# EasyEDA Pro project car1.eprj, schematic Schematic2_1

## Sheets
1 control: Board Name: 主板第二版; Create Date: 2025-04-05; Page Name: control; Project Name: car1; Schematic Name: Schematic2_1; Update Date: 2025-06-02; Company: 嘉立创EDA; Page Size: A4; Version: V1.0
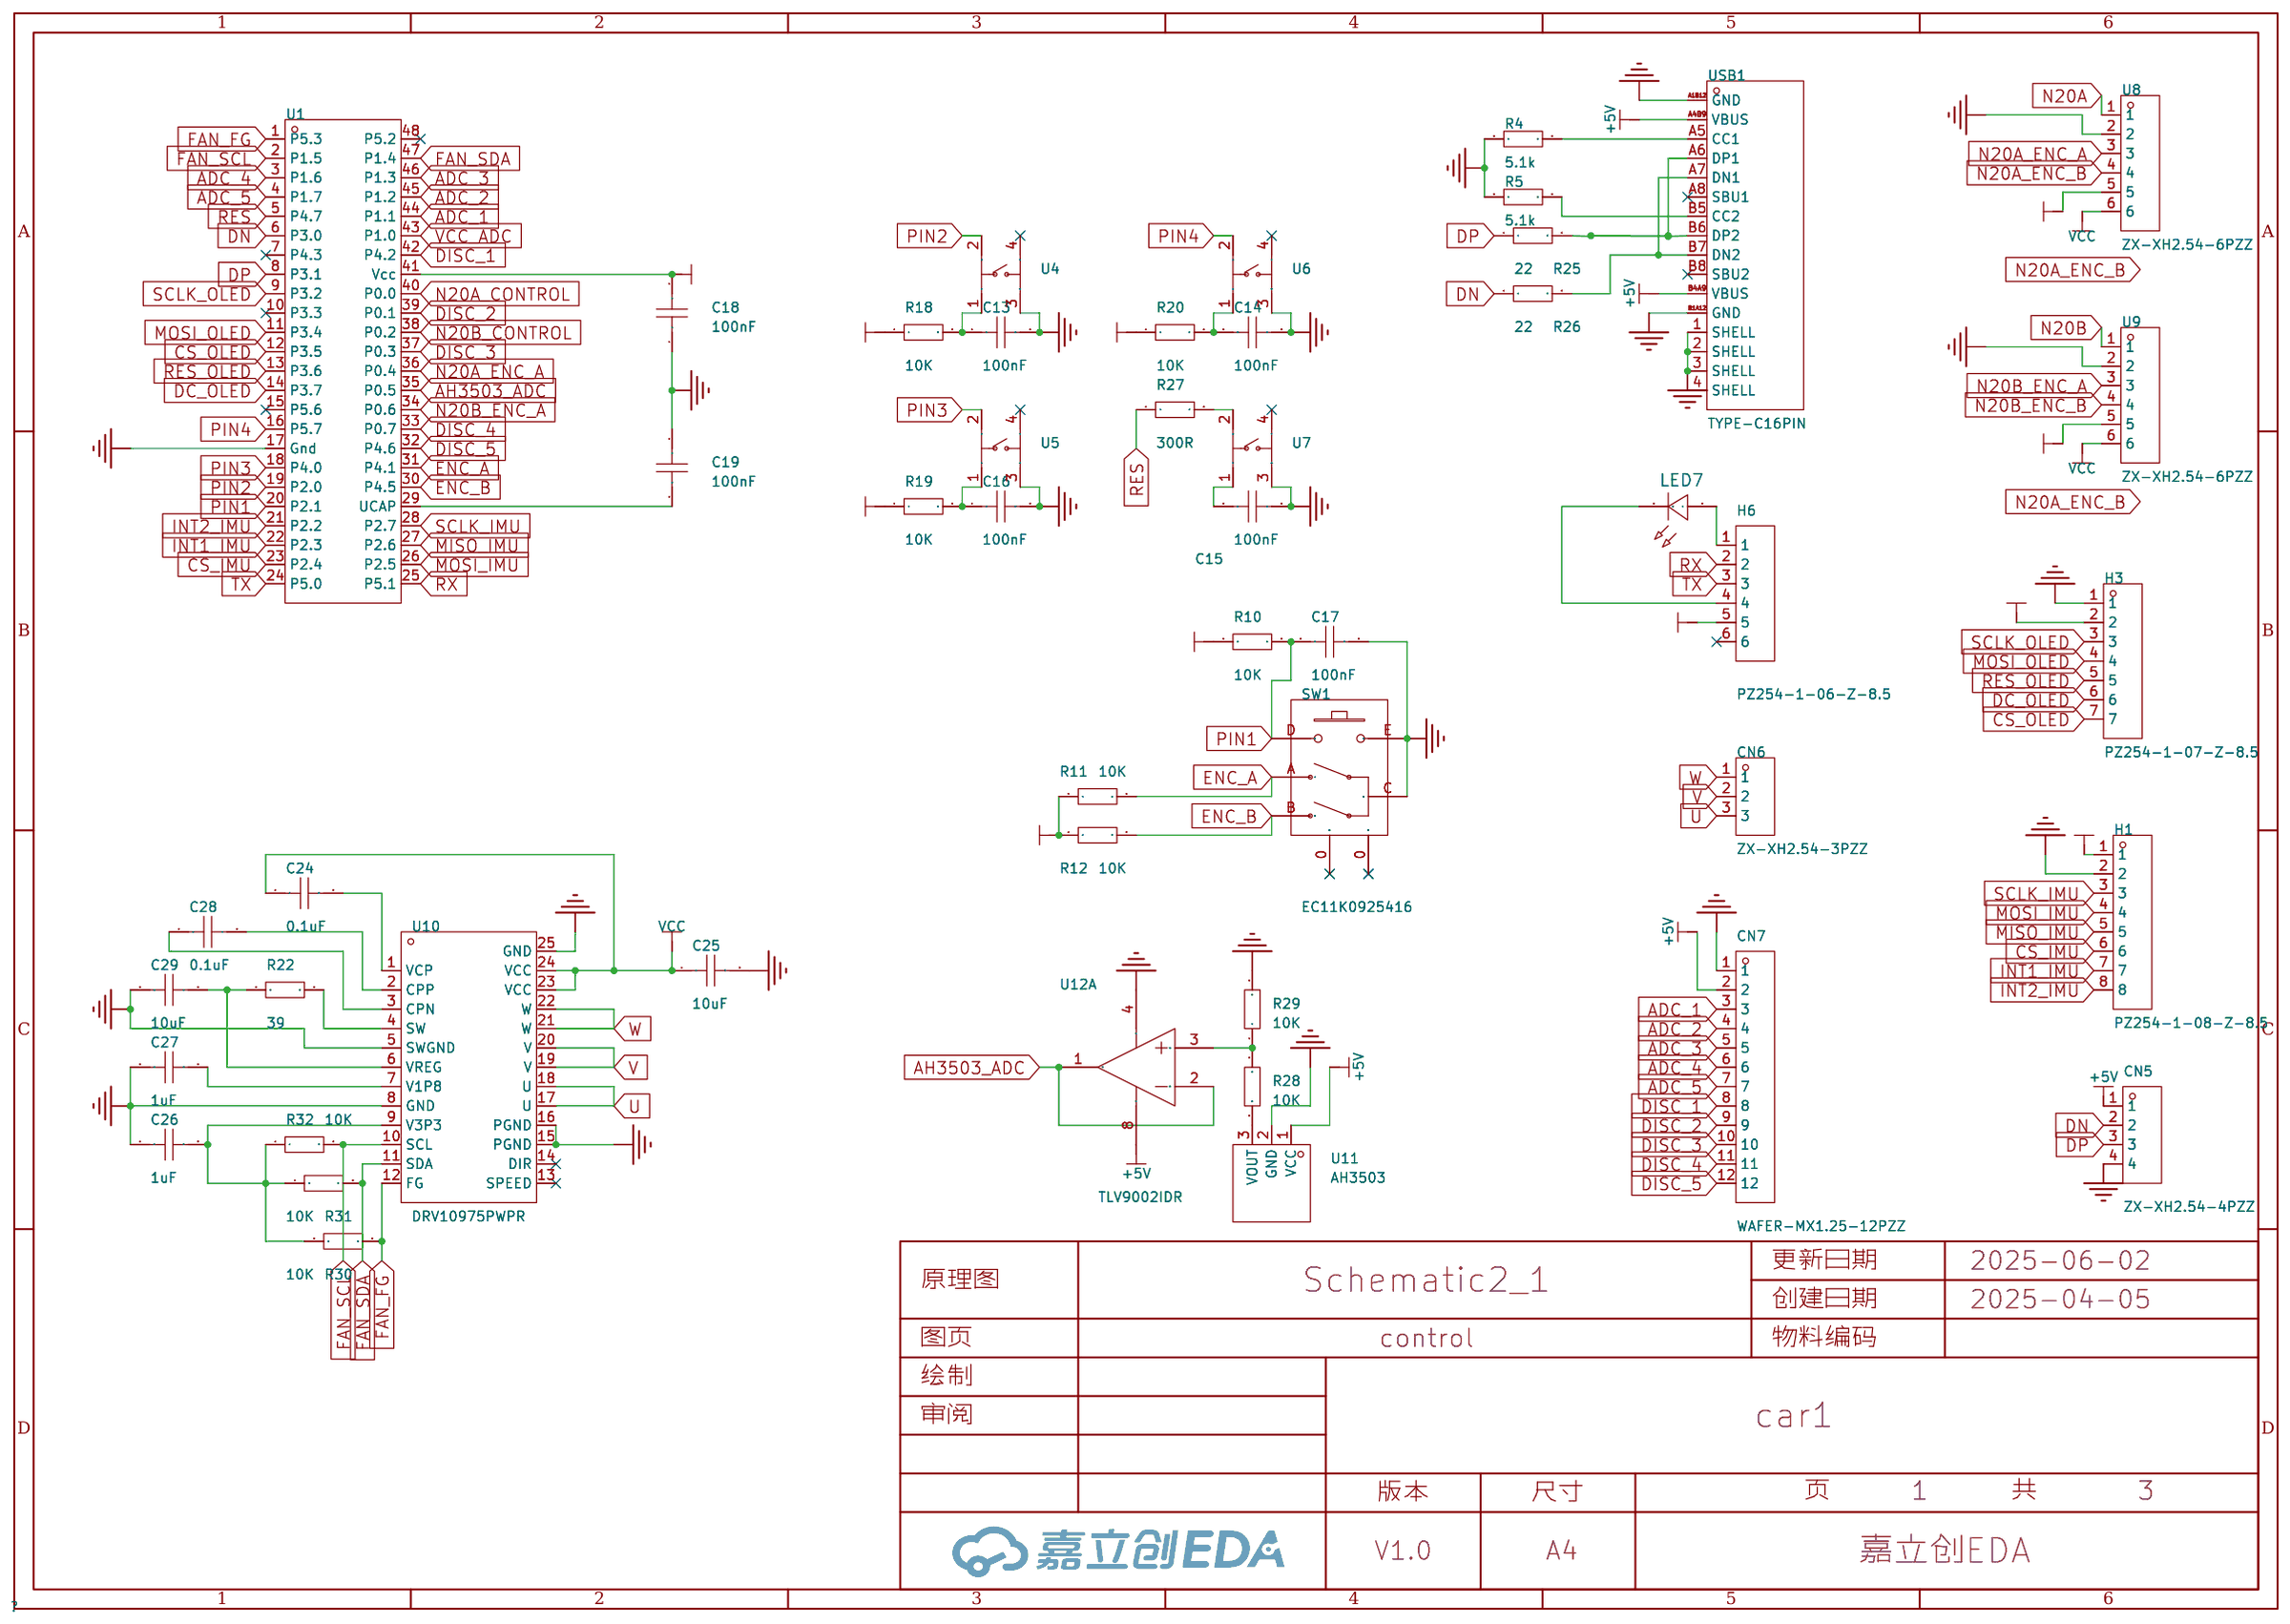
[diagram p4: control]
2 Power: Page Name: Power; Update Date: 2025-05-18
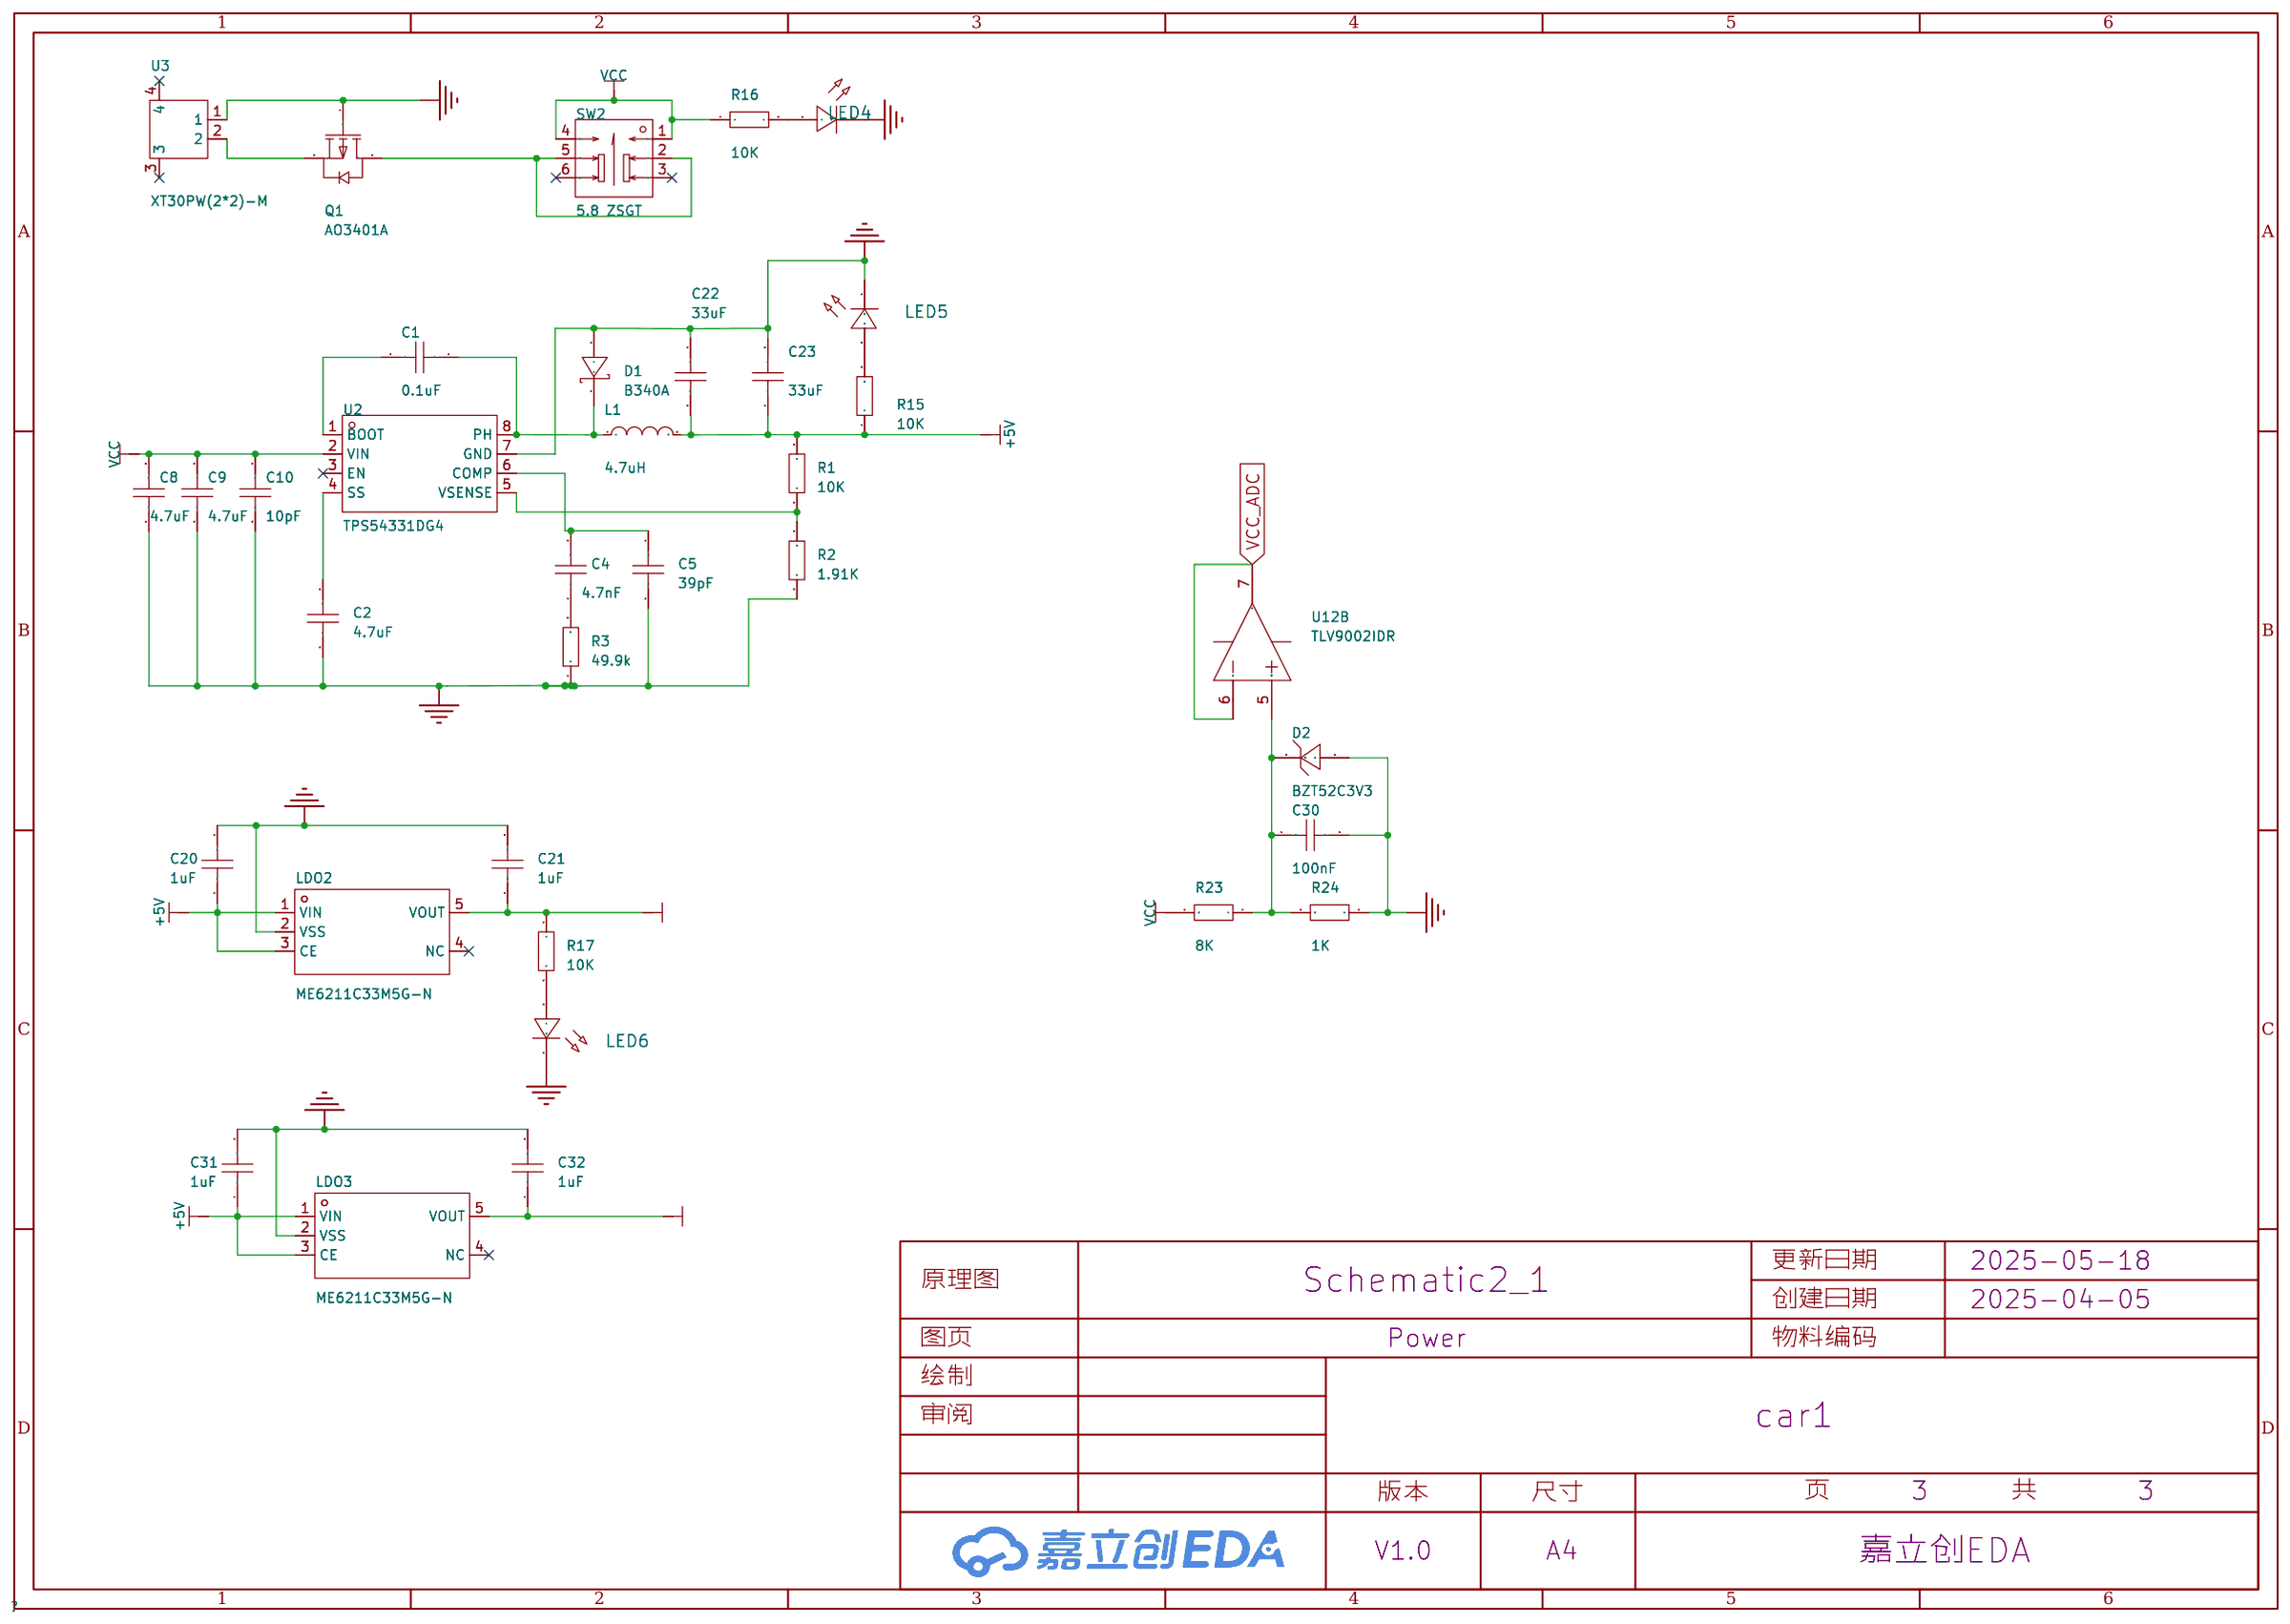
[diagram p5: Power]
3 Motor_Drive: Page Name: Motor_Drive; Update Date: 2025-05-02
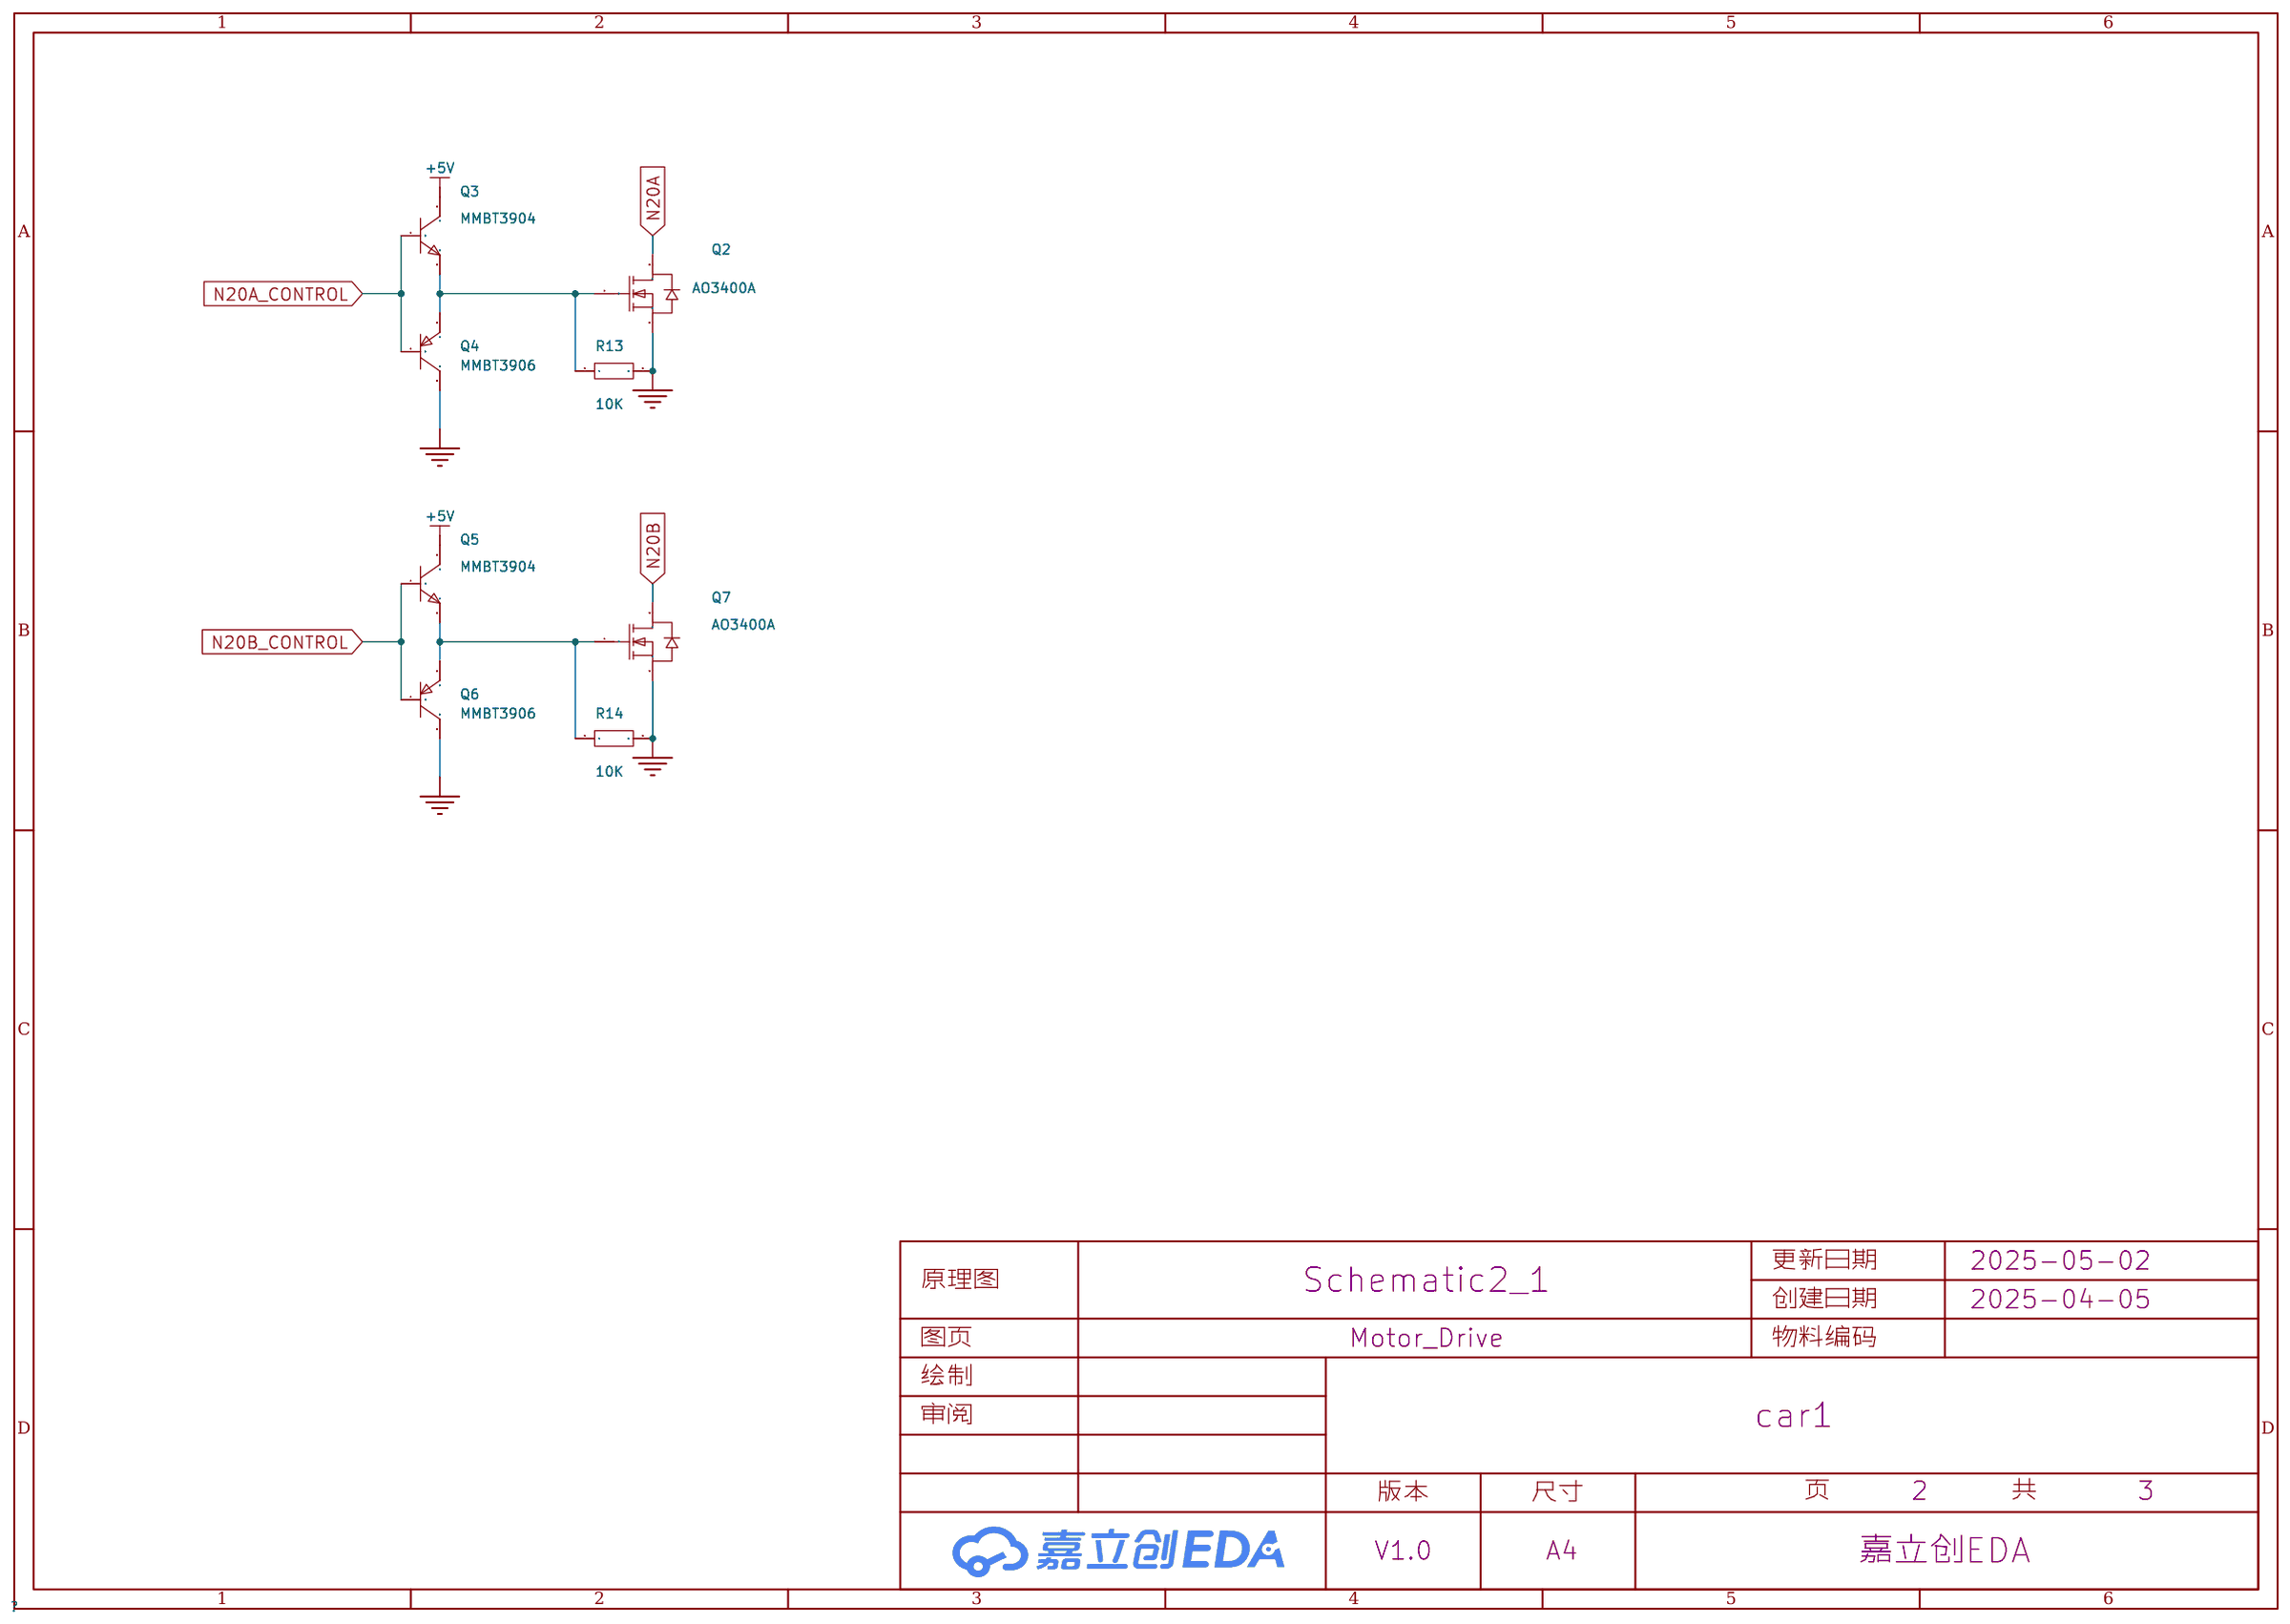
[diagram p6: Motor_Drive]

## Parts
sheet control
C13  100nF  [C0603]
C14  100nF  [C0603]
C15  100nF  [C0603]
C16  100nF  [C0603]
C17  100nF  [C0603]
C18  100nF  [C0603]
C19  100nF  [C0603]
C24  0.1uF  [C0603]
C25  10uF  [C0603]
C26  1uF  [C0603]
C27  1uF  [C0603]
C28  0.1uF  [C0603]
C29  10uF  [C0603]
CN5  ZX-XH2.54-4PZZ  [CONN-TH_4P-P2.50_4PIN]
CN6  ZX-XH2.54-3PZZ  [CONN-TH_3P-P2.54_2501S-3P]
CN7  WAFER-MX1.25-12PZZ  [CONN-TH_WAFER-MX1.25-12PZZ]
H1  PZ254-1-08-Z-8.5  [HDR-TH_8P-P2.54-V-M]
H3  PZ254-1-07-Z-8.5  [HDR-TH_07P-P2.54-V-M]
H6  PZ254-1-06-Z-8.5  [HDR-TH_06P-P2.54-V-M]
LED7  -  [LED_0603]
R4  5.1k  [R0603]
R5  5.1k  [R0603]
R10  10K  [R0603]
R11  10K  [R0603]
R12  10K  [R0603]
R18  10K  [R0603]
R19  10K  [R0603]
R20  10K  [R0603]
R22  39  [R0603]
R25  22  [R0603]
R26  22  [R0603]
R27  300R  [R0603]
R28  10K  [R0603]
R29  10K  [R0603]
R30  10K  [R0603]
R31  10K  [R0603]
R32  10K  [R0603]
SW1  EC11K0925416  [SW-TH_EC11K0925416]
U1  AI8051U-34K64-QFP48  [LQFP-48_L7.0-W7.0-P0.50-LS9.0-BL_1]
U4  TC-6610 6*6*5 160g  [SW-TH_4P-L6.0-W6.0-P4.50-LS6.5]
U5  TC-6610 6*6*5 160g  [SW-TH_4P-L6.0-W6.0-P4.50-LS6.5]
U6  TC-6610 6*6*5 160g  [SW-TH_4P-L6.0-W6.0-P4.50-LS6.5]
U7  TC-6610 6*6*5 160g  [SW-TH_4P-L6.0-W6.0-P4.50-LS6.5]
U8  ZX-XH2.54-6PZZ  [CONN-TH_6P-P2.50_ZX-XH2.54-6PZZ]
U9  ZX-XH2.54-6PZZ  [CONN-TH_6P-P2.50_ZX-XH2.54-6PZZ]
U10  DRV10975PWPR  [HTSSOP-24_L7.8-W4.4-P0.65-LS6.4-BL-EP]
U11  AH3503  [TO-92S_L4.0-W1.52-P1.27-R]
U12  TLV9002IDR  [SOIC-8_L4.9-W3.9-P1.27-LS6.0-BL]  (sections 1,2)
USB1  TYPE-C16PIN  [USB-C-SMD_TYPE-C16PIN]
sheet Motor_Drive
Q2  AO3400A  [SOT-23-3_L2.9-W1.3-P1.90-LS2.4-BR]
Q3  MMBT3904  [SOT-23-3_L2.9-W1.3-P1.90-LS2.4-BR]
Q4  MMBT3906  [SOT-23-3_L2.9-W1.3-P1.90-LS2.4-BR]
Q5  MMBT3904  [SOT-23-3_L2.9-W1.3-P1.90-LS2.4-BR]
Q6  MMBT3906  [SOT-23-3_L2.9-W1.3-P1.90-LS2.4-BR]
Q7  AO3400A  [SOT-23-3_L2.9-W1.3-P1.90-LS2.4-BR]
R13  10K  [R0603]
R14  10K  [R0603]
sheet Power
C1  0.1uF  [C0603]
C2  4.7uF  [C0603]
C4  4.7nF  [C0603]
C5  39pF  [C0603]
C8  4.7uF  [C0603]
C9  4.7uF  [C0603]
C10  10pF  [C0603]
C20  1uF  [C0603]
C21  1uF  [C0603]
C22  33uF  [C0603]
C23  33uF  [C0603]
C30  100nF  [C0603]
C31  1uF  [C0603]
C32  1uF  [C0603]
D1  B340A  [SMA_L4.3-W2.6-LS5.1-RD]
D2  BZT52C3V3  [SOD-123_L2.7-W1.6-LS3.7-RD-1]
L1  4.7uH  [IND-SMD_L4.9-W4.4_MAPM0420F]
LDO2  ME6211C33M5G-N  [SOT-23-5_L3.0-W1.7-P0.95-LS2.8-BL]
LDO3  ME6211C33M5G-N  [SOT-23-5_L3.0-W1.7-P0.95-LS2.8-BL]
LED4  -  [LED_0603]
LED5  -  [LED_0603]
LED6  -  [LED_0603]
Q1  AO3401A  [SOT-23_L2.9-W1.3-P1.90-LS2.4-BR]
R1  10K  [R0603]
R2  1.91K  [R0603]
R3  49.9k  [R0603]
R15  10K  [R0603]
R16  10K  [R0603]
R17  10K  [R0603]
R23  8K  [R0603]
R24  1K  [R0603]
SW2  5.8 ZSGT  [SW-TH_5.8ZSGT]
U2  TPS54331DG4  [SOIC-8_L4.9-W3.9-P1.27-LS6.0-BL]
U3  XT30PW(2*2)-M  [CONN-TH_XT30PW-M]

## Library data of the parts
C2 C4 C5 C8-C10 C13-C21 C31 C32 = CAP_0402: Supplier Footprint: 0402
C22-C30 = CAP_0603: Supplier Footprint: 0603
CN5 = ZX-XH2.54-4PZZ: 插针结构:1x4P;间距:2.54mm;安装方式:直插;参考系列:XH;总PIN数:4P;排数:1;每排PIN数:4;行距:-;额定电流:3A;触头材质:黄铜;触头镀层:锡;工作温度范围:-25℃~+85℃;; Supplier Part: C7429634; Manufacturer: Megastar(兆星); Supplier Footprint: 插件,P=2.5mm; JLCPCB Part Class: 扩展库; Datasheet: https://atta.szlcsc.com/upload/public/pdf/source/20230619/B529A2163E0159A644AB3383D208FB03.pdf; Supplier: LCSC; Pins Structure: 1x4P; Pitch: 2.54mm; Mounting Style: 直插; Reference Series: XH; Number of Pins: 4P; Number of Rows: 1; Number of PINs Per Row: 4; Current Rating (Max): 3A; Contact Material: 黄铜; Contact Plating: 锡; Operating Temperature Range: -25℃~+85℃
CN6 = ZX-XH2.54-3PZZ: 插针结构:1x3P;间距:2.54mm;安装方式:直插;参考系列:XH;总PIN数:3P;排数:1;每排PIN数:3;行距:-;额定电流:3A;触头材质:黄铜;触头镀层:锡;工作温度范围:-25℃~+85℃;; Supplier Part: C7429633; Manufacturer: Megastar(兆星); Supplier Footprint: 插件,P=2.54mm; JLCPCB Part Class: 扩展库; Datasheet: https://atta.szlcsc.com/upload/public/pdf/source/20230619/AE17037A2CFDBE8D9CBA775D61AD0A84.pdf; Supplier: LCSC; Pins Structure: 1x3P; Pitch: 2.54mm; Mounting Style: 直插; Reference Series: XH; Number of Pins: 3P; Number of Rows: 1; Number of PINs Per Row: 3; Current Rating (Max): 3A; Contact Material: 黄铜; Contact Plating: 锡; Operating Temperature Range: -25℃~+85℃
CN7 = WAFER-MX1.25-12PZZ: 插针结构:1x12P;间距:1.25mm;安装方式:直插;参考系列:PicoBlade(MX 1.25);总PIN数:12P;排数:1;每排PIN数:12;行距:-;额定电流:1A;触头材质:黄铜;触头镀层:-;工作温度:-25℃~+85℃;; LCSC Part Name: 1x12P 间距:1.25mm 直插 系列:PicoBlade(MX 1.25); Supplier Part: C22370332; Manufacturer: XUNPU(讯普); Supplier Footprint: 插件,P=1.25mm; JLCPCB Part Class: 扩展库; Datasheet: https://atta.szlcsc.com/upload/public/pdf/source/20220527/74EE44A637E2E6AE073051F308D41465.pdf; Supplier: LCSC; Pins Structure: 1x12P; Pitch: 1.25mm; Mounting Type: 直插; Reference Series: PicoBlade(MX 1.25); Number of Pins: 12P; Number of Rows: 1; Number of PINs Per Row: 12; Current Rating: 1A; Contact Material: 黄铜; Operating Temperature: -25℃~+85℃; Voltage Rating: 125V; Plastic Material: LCP; Color: 米色; Z-Height of the Board: 4.6mm; Y-Width of Bottom Edge on Board: 3.3mm
H1 = PZ254-1-08-Z-8.5: 插针结构:1x8P;间距:2.54mm;行距:-;圆针/方针:方针;安装类型:直插;排数:单排;总PIN位数:8P;额定电流:3A;额定电压:-;配合针长度:6mm;塑高:2.5mm;端接针长度:3mm;触头材质:黄铜;工作温度范围:-40℃~+105℃;焊接温度(最大值):260℃@10S;颜色:黑色;; LCSC Part Name: 1x8P 间距:2.54mm 方针 直插; Supplier Part: C2894931; Manufacturer: HCTL(华灿天禄); Supplier Footprint: 插件,P=2.54mm; JLCPCB Part Class: 扩展库; Datasheet: https://atta.szlcsc.com/upload/public/pdf/source/20240305/0F0A2A5C422E5D195558C9C26715A031.pdf; Supplier: LCSC; Pin Structure: 1x8P; Pitch: 2.54mm; Circluar Pins/Square Pins: 方针; Mounting Type: 直插; Number of Rows: 单排; Number of Pins: 8P; Current Rating (Max): 3A; Length of Mating Pin: 6mm; Insulation Height: 2.5mm; Length of End Connection Pin: 3mm; Contact Material: 黄铜; Operating Temperature Range: -40℃~+105℃; Soldering Temperature(Max): 260℃@10S; Color: 黑色
H3 = PZ254-1-07-Z-8.5: 插针结构:1x7P;间距:2.54mm;行距:-;圆针/方针:方针;安装类型:直插;排数:单排;总PIN位数:7P;额定电流:3A;额定电压:-;配合针长度:6mm;塑高:2.5mm;端接针长度:3mm;触头材质:黄铜;工作温度范围:-40℃~+105℃;焊接温度(最大值):260℃@10S;颜色:黑色;; LCSC Part Name: 1x7P 间距:2.54mm 方针 直插; Supplier Part: C2894930; Manufacturer: HCTL(华灿天禄); Supplier Footprint: 插件,P=2.54mm; JLCPCB Part Class: 扩展库; Datasheet: https://atta.szlcsc.com/upload/public/pdf/source/20240305/0F0A2A5C422E5D195558C9C26715A031.pdf; Supplier: LCSC; Pin Structure: 1x7P; Pitch: 2.54mm; Circluar Pins/Square Pins: 方针; Mounting Type: 直插; Number of Rows: 单排; Number of Pins: 7P; Current Rating (Max): 3A; Length of Mating Pin: 6mm; Insulation Height: 2.5mm; Length of End Connection Pin: 3mm; Contact Material: 黄铜; Operating Temperature Range: -40℃~+105℃; Soldering Temperature(Max): 260℃@10S; Color: 黑色
H6 = PZ254-1-06-Z-8.5: 插针结构:1x6P;间距:2.54mm;行距:-;圆针/方针:方针;安装类型:直插;排数:单排;总PIN位数:6P;额定电流:3A;额定电压:-;配合针长度:6mm;塑高:2.5mm;端接针长度:3mm;触头材质:黄铜;工作温度范围:-40℃~+105℃;焊接温度(最大值):260℃@10S;颜色:黑色;; LCSC Part Name: 1x6P 间距:2.54mm 方针 直插; Supplier Part: C2894929; Manufacturer: HCTL(华灿天禄); Supplier Footprint: 插件,P=2.54mm; JLCPCB Part Class: 扩展库; Datasheet: https://atta.szlcsc.com/upload/public/pdf/source/20240305/0F0A2A5C422E5D195558C9C26715A031.pdf; Supplier: LCSC; Pin Structure: 1x6P; Pitch: 2.54mm; Circluar Pins/Square Pins: 方针; Mounting Type: 直插; Number of Rows: 单排; Number of Pins: 6P; Current Rating (Max): 3A; Length of Mating Pin: 6mm; Insulation Height: 2.5mm; Length of End Connection Pin: 3mm; Contact Material: 黄铜; Operating Temperature Range: -40℃~+105℃; Soldering Temperature(Max): 260℃@10S; Color: 黑色
LED4-LED7 = LED_0603-R: Supplier Footprint: 0603
R1-R5 R10-R17 = Res_0402: Supplier Footprint: 0402
R18-R20 R22-R32 = Res_0603: Supplier Footprint: 0603
SW1 = EC11K0925416: Supplier Part: C219777; Manufacturer: ALPSALPINE(阿尔卑斯阿尔派); Supplier Footprint: 插件; JLCPCB Part Class: 扩展库; Datasheet: https://atta.szlcsc.com/upload/public/pdf/source/20220222/29C2476E448AF88AA1E99A46D9435970.pdf; Supplier: LCSC
U1 = AI8051U-34K64-QFP48: 硬件浮点/硬件三角函数 跑100MHz, 32位8051-CPU 跑 42MHz，PWM 有硬件移相功能，DMA支持外设到外设，DMA支持PWM; Supplier Part: C41427635; Manufacturer: STC; Supplier Footprint: QFP-48; JLCPCB Part Class: 扩展库; Datasheet: https://atta.szlcsc.com/upload/public/pdf/source/20241012/98E0A3F17C9CC280218AE3F266CCDE47.pdf; Supplier: LCSC
U4-U7 = TC-6610 6*6*5 160g: 轻触开关  6*6*5 160g力 4.3基座 复银 耐温 ROHS; Supplier Part: C7528706; Manufacturer: FG(富港); Supplier Footprint: 插件,6x6mm; JLCPCB Part Class: 扩展库; Datasheet: https://atta.szlcsc.com/upload/public/pdf/source/20240119/C4B5B07B03893BE63D1CA58047A0B7F3.pdf; Supplier: LCSC
U8 U9 = ZX-XH2.54-6PZZ: 插针结构:1x6P;间距:2.5mm;安装方式:直插;参考系列:XH;总PIN数:6P;排数:1;每排PIN数:6;行距:-;额定电流:3A;触头材质:黄铜;触头镀层:锡;工作温度范围:-25℃~+85℃;; LCSC Part Name: 1x6P 间距:2.5mm 直插 系列:XH; Supplier Part: C7429636; Manufacturer: Megastar(兆星); Supplier Footprint: 插件,P=2.5mm; JLCPCB Part Class: 扩展库; Datasheet: https://atta.szlcsc.com/upload/public/pdf/source/20230619/1243AD0A516E39CD3D274D8985780568.pdf; Supplier: LCSC; Pins Structure: 1x6P; Pitch: 2.5mm; Mounting Type: 直插; Reference Series: XH; Number of Pins: 6P; Number of Rows: 1; Number of PINs Per Row: 6; Rated Current: 3A; Contact Material: 黄铜; Contact Plating: 锡; Operating Temperature: -25℃~+85℃; Rated Voltage (Max): 250V; Plastic Material: PA66; Flame Retardant Rating: UL94V-0; Color: 白色; Z-Height of the Board: 7mm; X-Length of Bottom Edge on Board (Spacing Line): 17.5mm; Y-Width of Bottom Edge on Board: 5.9mm
U10 = DRV10975PWPR: DRV10975 12V 标称电压、2A 峰值无传感器正弦控制三相 BLDC 电机驱动器; Supplier Part: C701766; Manufacturer: TI(德州仪器); Supplier Footprint: HTSSOP-24-EP; JLCPCB Part Class: 扩展库; Datasheet: https://www.ti.com/cn/lit/gpn/drv10975; Supplier: LCSC; RDS(on): 250mΩ; Interface: I2C; Operating Temperature: -40℃~+125℃
U11 = AH3503: 霍尔传感芯片; LCSC Part Name: 线性霍尔电路; Supplier Part: C248991; Manufacturer: 南京艾驰; Supplier Footprint: TO-92S; JLCPCB Part Class: 扩展库; Datasheet: https://atta.szlcsc.com/upload/public/pdf/source/20191017/C248991_CFC9B8AAC885FEDD87E8E3E3EB49165B.pdf; Supplier: LCSC
U12 = TLV9002IDR: 放大器数:双路;轨到轨:-;增益带宽积(GBP):-;输入失调电压(Vos):1.6mV;压摆率(SR):2V/us;输入偏置电流(Ib):5pA;; Supplier Part: C398360; Manufacturer: TI(德州仪器); Supplier Footprint: SOIC-8; JLCPCB Part Class: 扩展库; Datasheet: https://www.ti.com/cn/lit/gpn/tlv9001; Supplier: LCSC; Number of Channels: 双路; Maximum Power Supply Range (Vdd-Vss): 5.5V; Vos - Input Offset Voltage: 1.6mV; Input Offset Voltage Drift(Vos TC): 0.6uV/℃; Slew Rate: 2V/us; Ib - Input Bias Current: 5pA; Noise density(eN): 4.7nV/√Hz@1kHz; Common Mode Rejection Ratio(CMRR): 86dB; Operating Temperature: -40℃~+125℃; Single supply: 1.8V~5.5V
USB1 = TYPE-C16PIN: 连接器类型:Type-C;标准:USB 3.1;公母:母;安装方式:卧贴;触点数量:16P;端口数量:1;额定电流 - 电源:3A;工作温度范围:-40℃~+85℃;; LCSC Part Name: Type-C 母 卧贴; Supplier Part: C393939; Manufacturer: SHOU HAN(首韩); Supplier Footprint: SMD; JLCPCB Part Class: 扩展库; Datasheet: https://atta.szlcsc.com/upload/public/pdf/source/20190521/C393939_7B9043D4CF1026AF443AB60D91FBCD5C.pdf; Supplier: LCSC; Connector Type: Type-C; Standard: USB 3.1; Gender: 母; Mounting Style: 卧贴; Number of Contacts: 16P; Number of Ports: 1; Current Rating - Power (Max): 3A; Operating Temperature Range: -40℃~+85℃; Rated Voltage (Max): 30V; Connect-Disconnect Life: 1万次; Core Colour: 黑色
Q2 Q7 = AO3400A_C20917: 类型:1个N沟道;漏源电压(Vdss):30V;连续漏极电流(Id):5.7A;导通电阻(RDS(on)@Vgs,Id):26.5mΩ@10V,5.7A;功率(Pd):1.4W;阈值电压(Vgs(th)@Id):1.5V@250uA;; LCSC Part Name: 1个N沟道 耐压:30V 电流:5.7A; Supplier Part: C20917; Manufacturer: AOS; Supplier Footprint: SOT-23-3L; JLCPCB Part Class: 基础库; Datasheet: https://atta.szlcsc.com/upload/public/pdf/source/20140107/1457706668533.pdf; Supplier: LCSC; Type: 1个N沟道; Drain Source Voltage (Vdss): 30V; Continuous Drain Current (Id): 5.7A; Drain Source On Resistance (RDS(on)@Vgs,Id): 26.5mΩ@10V,5.7A; Power Dissipation (Pd): 1.4W; Gate Threshold Voltage (Vgs(th)@Id): 1.5V@250uA; Total Gate Charge (Qg@Vgs): 7nC@4.5V; Input Capacitance (Ciss@Vds): 630pF@15V; Operating Temperature: -55℃~+150℃@(Tj)
Q3 Q5 = MMBT3904(RANGE:100-300): 晶体管类型:NPN;集电极电流(Ic):200mA;集射极击穿电压(Vceo):40V;功率(Pd):200mW;直流电流增益(hFE@Ic,Vce):100@10mA,1V;; LCSC Part Name: NPN 电流:200mA 耐压:40V hfe=100~300; Supplier Part: C20526; Manufacturer: CJ(江苏长电/长晶); Supplier Footprint: SOT-23; JLCPCB Part Class: 基础库; Datasheet: https://atta.szlcsc.com/upload/public/pdf/source/20220704/70F575FB75061E03F919270A6BB8BA7F.pdf; Supplier: LCSC; Transistor Type: NPN; Collector Current (Ic): 200mA; Collector-Emitter Breakdown Voltage (Vceo): 40V; Power Dissipation (Pd): 200mW; DC Current Gain (hFE@Ic,Vce): 100@10mA,1V; Transition Frequency (fT): 300MHz; Collector Cut-Off Current (Icbo): 100nA; Collector-Emitter Saturation Voltage (VCE(sat)@Ic,Ib): 300mV@50mA,5mA
Q4 Q6 = MMBT3906_C18195368: Supplier Part: C18195368; Manufacturer: LJ(朗捷）; Supplier Footprint: SOT-23; Datasheet: https://atta.szlcsc.com/upload/public/pdf/source/20230921/EBEA0117477174C76530FD120E2EA419.pdf; Supplier: LCSC
C1 = CAP_0402: MLCC; Supplier Footprint: 0402
D1 = B340A: 二极管配置:独立式;正向压降(Vf):550mV@3A;直流反向耐压(Vr):40V;整流电流:3A;; LCSC Part Name: 电压:40V 电流:3A; Supplier Part: C64982; Manufacturer: MDD(辰达半导体); Supplier Footprint: SMA(DO-214AC); JLCPCB Part Class: 扩展库; Datasheet: https://atta.szlcsc.com/upload/public/pdf/source/20240710/591710C3B34CDB7FE3DA92C119E6F598.pdf; Supplier: LCSC; Diode Configuration: 独立式; Forward Voltage (Vf@If): 550mV@3A; Reverse Voltage (Vr): 40V; Rectified Current: 3A; Reverse Leakage Current (Ir): 500uA@40V
D2 = BZT52C3V3: 二极管配置:-;稳压值(标称值):3.3V;稳压值(范围):3.3V~3.5V;功率(Pd):500mW;; Supplier Part: C2891770; Manufacturer: YONGYUTAI(永裕泰); Supplier Footprint: SOD-123; JLCPCB Part Class: 扩展库; Datasheet: https://atta.szlcsc.com/upload/public/pdf/source/20210901/8FC2376A01E96D0346FF8B134DC7A446.pdf; Supplier: LCSC; Zener Voltage (Nom): 3.3V; Reverse Leakage Current (Ir): 5uA@1V; Zener Voltage (Range): 3.3V~3.5V; Power Dissipation: 500mW; Zener Impedance (Zzt): 95Ω
L1 = HA42-4R7MT: 电感值:4.7uH;精度:±20%;额定电流:2A;饱和电流(Isat):3A;; LCSC Part Name: 4.7uH ±20% 3A; Supplier Part: C2936653; Manufacturer: FH(风华); Supplier Footprint: 0420; JLCPCB Part Class: 扩展库; Datasheet: https://atta.szlcsc.com/upload/public/pdf/source/20211228/DF5AAD1C624D1DACD739A51BD94418BC.pdf; Supplier: LCSC; Tolerance: ±20%; Rated Current: 2A; Saturation Current (Isat): 3A; DC Resistance (DCR): 150mΩ
LDO2 LDO3 = ME6211C33M5G-N: 输出类型:固定;最大输入电压:6V;输出电压:3.3V;最大输出电流:500mA;电源纹波抑制比(PSRR):70dB;输出极性:正极;; LCSC Part Name: 输入6V 输出3.3V 500mA; Supplier Part: C82942; Manufacturer: MICRONE(南京微盟); Supplier Footprint: SOT-23-5; JLCPCB Part Class: 扩展库; Datasheet: https://atta.szlcsc.com/upload/public/pdf/source/20170918/C82942_1505727073070976520.pdf; Supplier: LCSC; Output Type: 固定; Maximum Input Voltage: 6V; Output Voltage: 3.3V; MAX Output Current: 500mA; Power Supply Rejection Ratio (PSRR): 70dB; Dropout Voltage: 260mV@(200mA); Output Polarity: 正极; Number of Outputs: 1
Q1 = AO3401A_C15127: 类型:1个P沟道;漏源电压(Vdss):30V;连续漏极电流(Id):4A;导通电阻(RDS(on)@Vgs,Id):44mΩ@10V,4.3A;功率(Pd):1.4W;阈值电压(Vgs(th)@Id):1.3V@250uA;; LCSC Part Name: 1个P沟道 耐压:30V 电流:4A; Supplier Part: C15127; Manufacturer: AOS; Supplier Footprint: SOT-23; JLCPCB Part Class: 基础库; Datasheet: https://atta.szlcsc.com/upload/public/pdf/source/20160507/1462613609053.pdf; Supplier: LCSC; Type: 1个P沟道; Drain Source Voltage (Vdss): 30V; Continuous Drain Current (Id): 4A; Drain Source On Resistance (RDS(on)@Vgs,Id): 44mΩ@10V,4.3A; Power Dissipation (Pd): 1.4W; Gate Threshold Voltage (Vgs(th)@Id): 1.3V@250uA; Total Gate Charge (Qg@Vgs): 12.2nC@4.5V; Input Capacitance (Ciss@Vds): 1.2nF@15V; Operating Temperature: -55℃~+150℃@(Tj)
SW2 = 5.8 ZSGT: 电路结构:双刀双掷;自锁/无锁:自锁;安装方式:直插;触点电流:110mA;额定电压 (DC):30V;带灯:不带;作用力:1.5N;机械寿命:10万次;; LCSC Part Name: 5.8*5.8有头/高头 带锁/自锁开关 泡泡机开关; Supplier Part: C2681587; Manufacturer: SHOU HAN(首韩); Supplier Footprint: 插件; JLCPCB Part Class: 扩展库; Datasheet: https://atta.szlcsc.com/upload/public/pdf/source/20210107/C2681587_CDDDDA4A1C7AC9FEB01815B75893A6BA.pdf; Supplier: LCSC; Circuit: 双刀双掷; Self Lock / No Lock: 自锁; Actuator Style: 方形按钮; Mounting Style: 直插; Contact Current: 110mA; Voltage Rating (DC): 30V; Insulation Resistance: 100MΩ; Actuator/Cap Color: 白色; With Lamp: 不带; Pin Style: PC引脚; Operating Force: 1.5N; Operating Temperature: -10℃~+70℃; Mechanical Life: 10万次
U2 = TPS54331DG4: 功能类型:降压型;输出类型:可调;输入电压:3.5V~28V;输出电压:800mV~25V;输出电流:3A;; Supplier Part: C1356164; Manufacturer: TI(德州仪器); Supplier Footprint: SOIC-8; JLCPCB Part Class: 扩展库; Datasheet: https://www.ti.com/cn/lit/gpn/tps54331; Supplier: LCSC; Function: 降压型; Output Type: 可调; Input Voltage: 3.5V~28V; Output Voltage: 800mV~25V; Output Current: 3A; Switching Frequency: 570kHz; Operating Temperature: -40℃~+150℃@(TJ); Synchronous Rectification: 否; Number of Outputs: 1; Topology: 降压式; Switch tube (built-in/external): 内置
U3 = XT30PW(2*2)-M: Supplier Part: C9900097120; JLCPCB Part Class: 扩展库; Supplier: LCSC

## Nets
3.3V: C18.2 C21.1 H1.1 H3.2 H6.5 LDO2.5(VOUT) R10.1 R11.1 R12.1 R17.1 R18.1 R19.1 R20.1 U1.41(Vcc)
3.3V_1: C32.1 LDO3.5(VOUT) U8.5 U9.5
+5V: C20.1 C23.1 C31.1 CN5.1 CN7.2 LDO2.1(VIN) LDO2.3(CE) LDO3.1(VIN) LDO3.3(CE) Q3.3(C) Q5.3(C) R1.2 R15.1 U11.1(VCC) U12.8(V+) USB1.A4B9(VBUS) USB1.B4A9(VBUS)
GND: C2.1 C5.1 C8.1 C9.1 C10.1 C13.2 C14.2 C15.2 C16.2 C17.2 C18.1 C19.1 C20.2 C21.2 C22.1 C23.2 C25.2 C26.1 C27.1 C29.1 C30.2 C31.2 C32.2 CN5.4 CN7.1 D1.2(A) D2.2 H1.2 H3.1 H6.4 LDO2.2(VSS) LDO3.2(VSS) LED4.1(C) LED5.1(C) LED6.1(C) LED7.1(C) Q1.1(G) Q2.2(S) Q4.3(C) Q6.3(C) Q7.2(S) R2.1 R3.1 R4.1 R5.1 R13.2 R14.2 R24.1 R29.2 SW1.C SW1.E U1.17(Gnd) U2.7(GND) U3.1 U4.3 U5.3 U6.3 U7.3 U8.2 U9.2 U10.5(SWGND) U10.8(GND) U10.15(PGND) U10.16(PGND) U10.25(GND) U11.2(GND) U12.4(V-) USB1.1(SHELL) USB1.2(SHELL) USB1.3(SHELL) USB1.4(SHELL) USB1.A1B12(GND) USB1.B1A12(GND)
VCC: C8.2 C9.2 C10.2 C24.1 C25.1 R16.1 R23.2 SW2.1 SW2.4 U2.2(VIN) U8.6 U9.6 U10.23(VCC) U10.24(VCC)
VCC_ADC: U1.43(P1.0) U12.6(IN2-) U12.7(OUT2)
ADC_1: CN7.3 U1.44(P1.1)
ADC_2: CN7.4 U1.45(P1.2)
ADC_3: CN7.5 U1.46(P1.3)
ADC_4: CN7.6 U1.3(P1.6)
ADC_5: CN7.7 U1.4(P1.7)
AH3503_ADC: U1.35(P0.5) U12.1(OUT1) U12.2(IN1-)
CS_IMU: H1.6 U1.23(P2.4)
CS_OLED: H3.7 U1.12(P3.5)
DC_OLED: H3.6 U1.14(P3.7)
DISC_1: CN7.8 U1.42(P4.2)
DISC_2: CN7.9 U1.39(P0.1)
DISC_3: CN7.10 U1.37(P0.3)
DISC_4: CN7.11 U1.33(P0.7)
DISC_5: CN7.12 U1.32(P4.6)
DN: CN5.2 R26.1 U1.6(P3.0)
DP: CN5.3 R25.1 U1.8(P3.1)
ENC_A: R11.2 SW1.A U1.31(P4.1)
ENC_B: R12.2 SW1.B U1.30(P4.5)
FAN_FG: R30.2 U1.1(P5.3) U10.12(FG)
FAN_SCL: R32.2 U1.2(P1.5) U10.10(SCL)
FAN_SDA: R31.2 U1.47(P1.4) U10.11(SDA)
INT1_IMU: H1.7 U1.22(P2.3)
INT2_IMU: H1.8 U1.21(P2.2)
MISO_IMU: H1.5 U1.27(P2.6)
MOSI_IMU: H1.4 U1.26(P2.5)
MOSI_OLED: H3.4 U1.11(P3.4)
N20A: Q2.3(D) U8.1
N20A_CONTROL: Q3.1(B) Q4.1(B) U1.40(P0.0)
N20A_ENC_A: U1.36(P0.4) U8.3
N20A_ENC_B: U8.4
N20B: Q7.3(D) U9.1
N20B_CONTROL: Q5.1(B) Q6.1(B) U1.38(P0.2)
N20B_ENC_A: U1.34(P0.6) U9.3
N20B_ENC_B: U9.4
PIN1: C17.1 R10.2 SW1.D U1.20(P2.1)
PIN2: U1.19(P2.0) U4.2
PIN3: U1.18(P4.0) U5.2
PIN4: U1.16(P5.7) U6.2
RES: R27.1 U1.5(P4.7)
RES_OLED: H3.5 U1.13(P3.6)
RX: H6.2 U1.25(P5.1)
SCLK_IMU: H1.3 U1.28(P2.7)
SCLK_OLED: H3.3 U1.9(P3.2)
TX: H6.3 U1.24(P5.0)
U: CN6.3 U10.17(U) U10.18(U)
V: CN6.2 U10.19(V) U10.20(V)
W: CN6.1 U10.21(W) U10.22(W)
$1N1528: R4.2 USB1.A5(CC1)
$1N1529: R5.2 USB1.B5(CC2)
$1N6312: C19.2 U1.29(UCAP)
$1N10364: C16.1 R19.2 U5.1
$1N10369: C14.1 R20.2 U6.1
$1N10374: C15.1 U7.1
$1N10398: C13.1 R18.2 U4.1
$1N12607: C24.2 U10.1(VCP)
$1N12642: C27.2 U10.7(V1P8)
$1N12649: C28.1 U10.3(CPN)
$1N12654: R22.2 U10.4(SW)
$1N12657: C28.2 U10.2(CPP)
$1N12661: C29.2 R22.1 U10.6(VREG)
$1N12947: H6.1 LED7.2(A)
$1N17349: R25.2 USB1.A6(DP1) USB1.B6(DP2)
$1N17383: R26.2 USB1.A7(DN1) USB1.B7(DN2)
$1N24115: R28.2 U11.3(VOUT)
$1N24177: R28.1 R29.1 U12.3(IN1+)
$1N28693: C26.2 R30.1 R31.1 R32.1 U10.9(V3P3)
$1N30303: R27.2 U7.2
$2N526: C1.2 U2.1(BOOT)
$2N663: C2.2 U2.4(SS)
$2N1009: R1.1 R2.2 U2.5(VSENSE)
$2N1098: C4.2 C5.2 U2.6(COMP)
$2N1203: C4.1 R3.2
$2N6020: Q1.2(S) U3.2
$2N6234: Q1.3(D) SW2.2 SW2.5
$2N11866: LED4.2(A) R16.2
$2N11894: LED5.2(A) R15.2
$2N11946: LED6.2(A) R17.2
$2N13681: C30.1 D2.1 R23.1 R24.2 U12.5(IN2+)
$3N447: Q2.1(G) Q3.2(E) Q4.2(E) R13.1
$3N743: Q5.2(E) Q6.2(E) Q7.1(G) R14.1
Net-(C1-1): C1.1 D1.1(K) U2.8(PH)

Not connected (* = marked no-connect by the designer): C22 2; H6 6*; L1 1 2; LDO2 4(NC)*; LDO3 4(NC)*; SW1 0(MH1)*; SW2 3* 6*; U1 7(P4.3)* 10(P3.3)* 15(P5.6)* 48(P5.2)*; U2 3(EN)*; U3 3* 4*; U4 4*; U5 4*; U6 4*; U7 4*; U10 13(SPEED)* 14(DIR)*; USB1 A8(SBU1)* B8(SBU2)*
